# EAGLE schematic FDC9266_floppyboard (EAGLE 9.6.2)
Assembly variants: rcbus
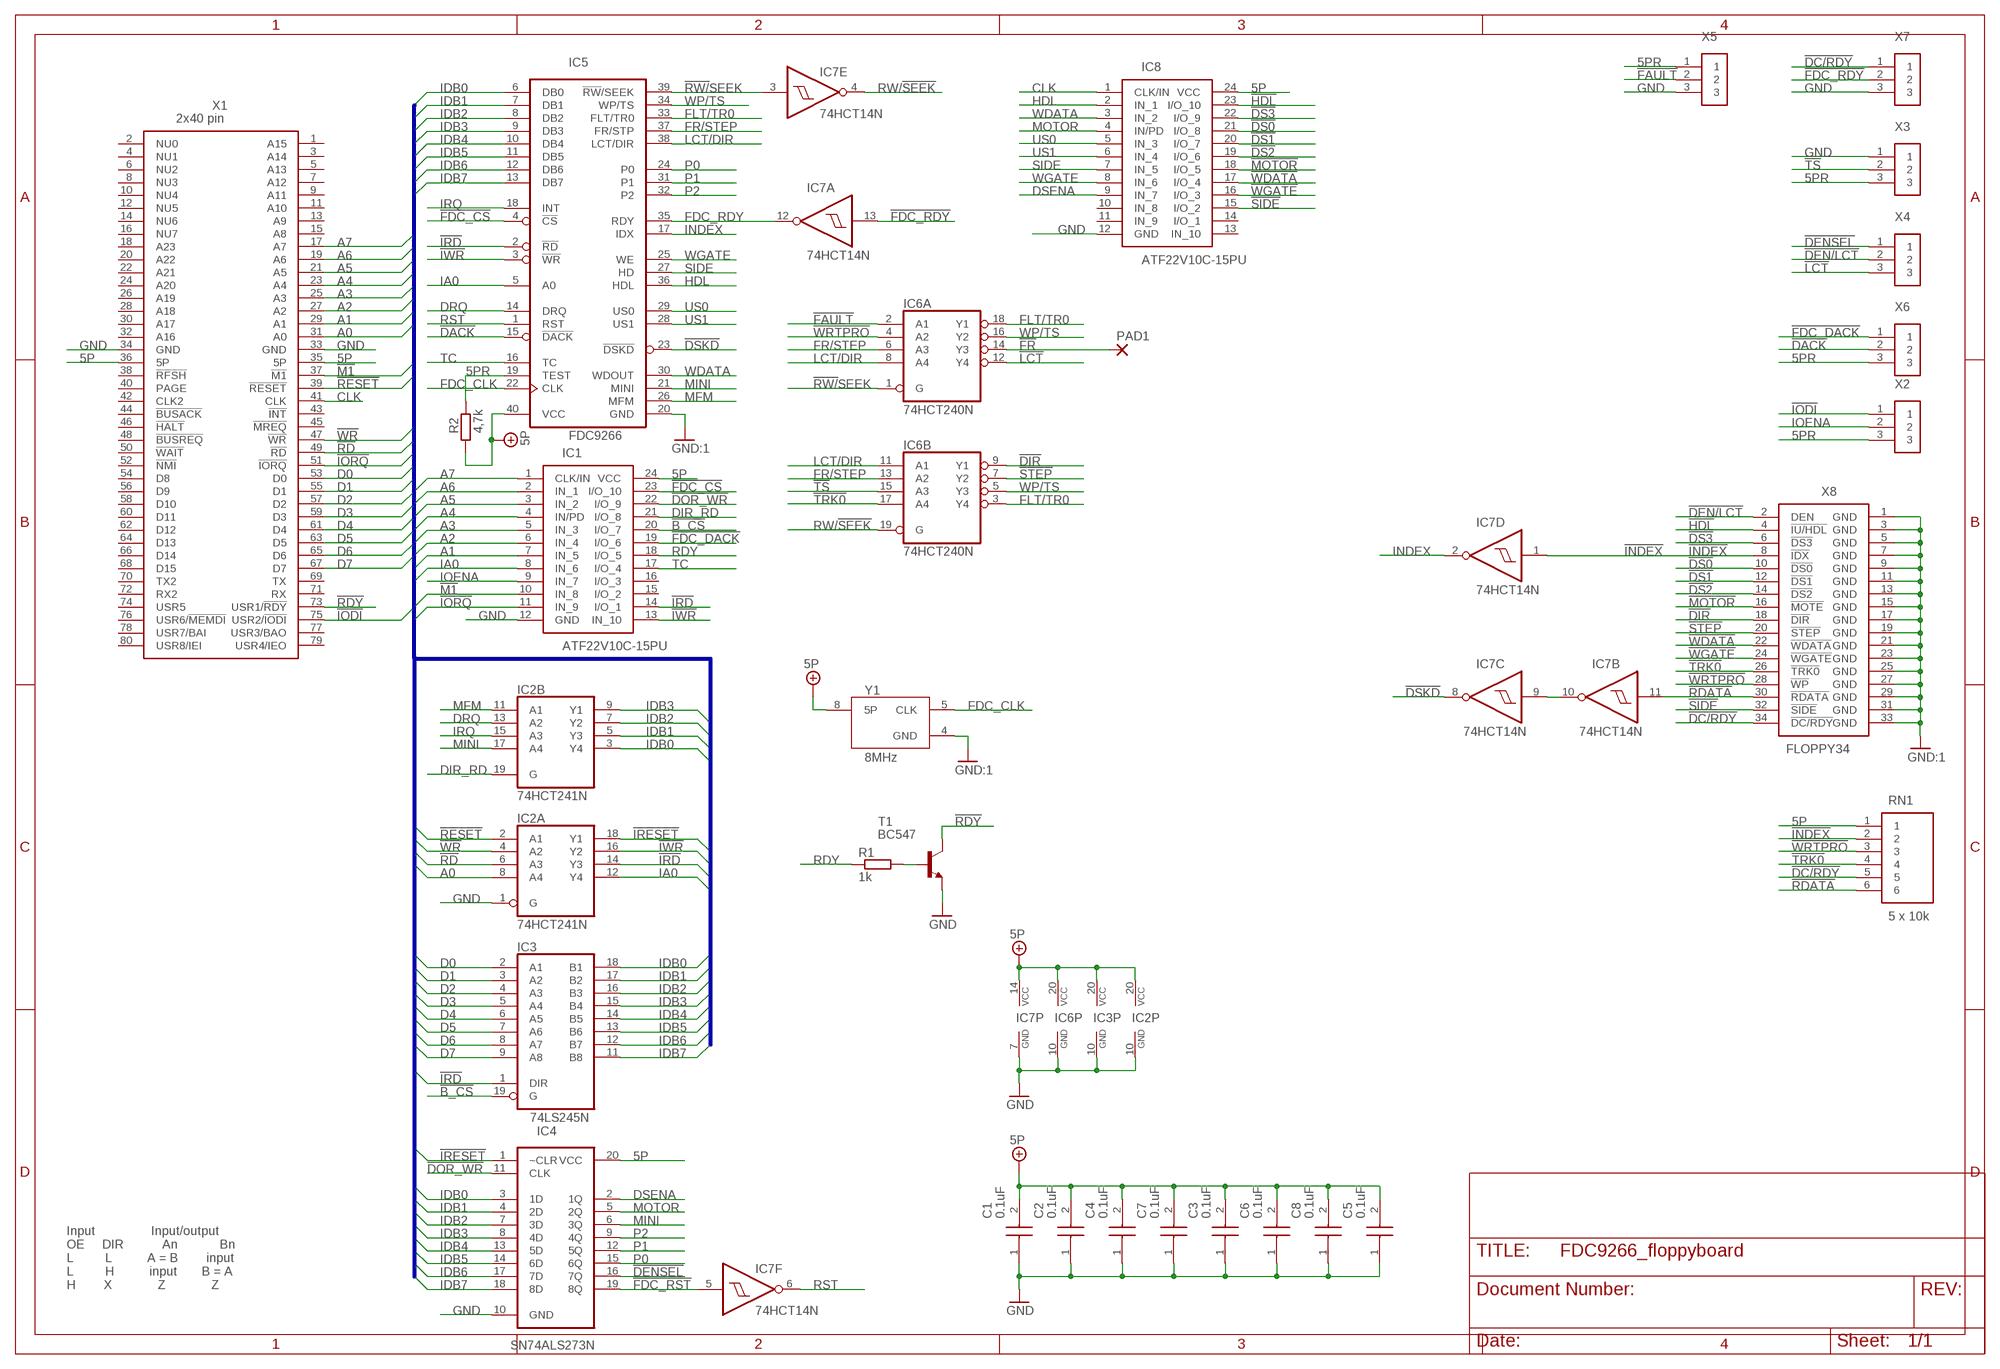
[diagram p0: schematic, sheet 1]

## Parts
C1  0.1uF  C315C103K5R5TA7303  [C315C103K5R5TA7303]
C2  0.1uF  C315C103K5R5TA7303  [C315C103K5R5TA7303]
C3  0.1uF  C315C103K5R5TA7303  [C315C103K5R5TA7303]
C4  0.1uF  C315C103K5R5TA7303  [C315C103K5R5TA7303]
C5  0.1uF  C315C103K5R5TA7303  [C315C103K5R5TA7303]
C6  0.1uF  C315C103K5R5TA7303  [C315C103K5R5TA7303]
C7  0.1uF  C315C103K5R5TA7303  [C315C103K5R5TA7303]
C8  0.1uF  C315C103K5R5TA7303  [C315C103K5R5TA7303]
IC1  ATF22V10C-15PU  [DIP794W56P254L3188H533Q24N]
IC2  74HCT241N  [DIL20]
IC3  74LS245N  [DIL20]
IC4  SN74ALS273N  [DIP254P762X508-20]
IC5  FDC9266  [DIP1550W53P254L5232H424Q40N]
IC6  74HCT240N  [DIL20]
IC7  74HCT14N  [DIL14]
IC8  ATF22V10C-15PU  [DIP794W56P254L3188H533Q24N]
PAD1  WIREPAD1,6/0,8  [1,6/0,8]
R1  1k  R_EU_020710  [0207/10]  (not fitted in variant rcbus)
R2  4,7k  R_EU_020710  [0207/10]
RN1  5 x 10k  4606X-101-103LF  [4606X102103LF]
T1  BC547  [TO92]  (not fitted in variant rcbus)
X1  2x40 pin  RCBUS_80_RA  [RC2014_80_RA]
X2  TSW-103-07-G-S07  [TSW-103-XX-G-S]
X3  TSW-103-07-G-S07  [TSW-103-XX-G-S]
X4  TSW-103-07-G-S07  [TSW-103-XX-G-S]
X5  TSW-103-07-G-S07  [TSW-103-XX-G-S]
X6  TSW-103-07-G-S07  [TSW-103-XX-G-S]
X7  TSW-103-07-G-S07  [TSW-103-XX-G-S]
X8  FLOPPY34  [09185346323]
Y1  8MHz  ECS-2100AX-200  [ECS-2100AX-200]

## Nets
5P: C1.2 C2.2 C3.2 C4.2 C5.2 C6.2 C7.2 C8.2 IC1.24(VCC) IC2.20(P:VCC) IC3.20(VCC) IC4.20(VCC) IC5.40(VCC) IC6.20(P:VCC) IC7.14(P:VCC) IC8.24(VCC) R2.1 RN1.1 X1.35(5P) X1.36(5P) Y1.8(5P)
5PR: IC5.19(TEST) R2.2 X2.3 X3.3 X5.1 X6.3
!B_CS: IC1.20(I/O_7) IC3.19(G)
!DACK: IC5.15(!DACK) X6.2
!DC/RDY: RN1.5 X7.1 X8.34(!DC/RDY)
!DEN/LCT: X4.2 X8.2(DEN)
!DENSEL: IC4.16(7Q) X4.1
!DIR: IC6.9(B:Y1) X8.18(!DIR)
!DOR_WR: IC1.22(I/O_9) IC4.11(CLK)
!DS0: IC8.21(I/O_8) X8.10(!DS0)
!DS1: IC8.20(I/O_7) X8.12(!DS1)
!DS2: IC8.19(I/O_6) X8.14(!DS2)
!DS3: IC8.22(I/O_9) X8.6(!DS3)
!DSKD: IC5.23(!DSKD) IC7.8(C:O)
!FAULT: IC6.2(A:A1) X5.2
!FDC_CS: IC1.23(I/O_10) IC5.4(!CS)
!FDC_DACK: IC1.19(I/O_6) X6.1
!FDC_RDY: IC7.13(A:I) X7.2
!FDC_RST: IC4.19(8Q) IC7.5(F:I)
!FR: IC6.14(A:Y3) PAD1.1(P)
!HDL: IC8.23(I/O_10) X8.4(!IU/HDL)
!INDEX: IC7.1(D:I) RN1.2 X8.8(!IDX)
!IODI: X1.75(USR2/!IODI) X2.1
!IORQ: IC1.11(IN_9) X1.51(!IORQ)
!IRD: IC1.14(I/O_1) IC2.14(A:Y3) IC3.1(DIR) IC5.2(!RD)
!IRESET: IC2.18(A:Y1) IC4.1(~CLR)
!IWR: IC1.13(IN_10) IC2.16(A:Y2) IC5.3(!WR)
!LCT: IC6.12(A:Y4) X4.3
!M1: IC1.10(IN_8) X1.37(!M1)
!MOTOR: IC8.18(I/O_5) X8.16(!MOTE)
!RD: IC2.6(A:A3) X1.49(!RD)
!RDATA: IC7.11(B:I) RN1.6 X8.30(!RDATA)
!RDY: T1.3(C) X1.73(USR1/!RDY)
!RESET: IC2.2(A:A1) X1.39(!RESET)
!RW/!SEEK: IC5.39(!RW!/SEEK) IC6.1(A:G) IC7.3(E:I)
!SIDE: IC8.15(I/O_2) X8.32(!SIDE)
!STEP: IC6.7(B:Y2) X8.20(!STEP)
!TRK0: IC6.17(B:A4) RN1.4 X8.26(!TRK0)
!TS: IC6.15(B:A3) X3.2
!WDATA: IC8.17(I/O_4) X8.22(!WDATA)
!WGATE: IC8.16(I/O_3) X8.24(!WGATE)
!WR: IC2.4(A:A2) X1.47(!WR)
!WRTPRO: IC6.4(A:A2) RN1.3 X8.28(!WP)
A0: IC2.8(A:A4) X1.31(A0)
A1: IC1.7(IN_5) X1.29(A1)
A2: IC1.6(IN_4) X1.27(A2)
A3: IC1.5(IN_3) X1.25(A3)
A4: IC1.4(IN/PD) X1.23(A4)
A5: IC1.3(IN_2) X1.21(A5)
A6: IC1.2(IN_1) X1.19(A6)
A7: IC1.1(CLK/IN) X1.17(A7)
CLK: IC8.1(CLK/IN) X1.41(CLK)
D0: IC3.2(A1) X1.53(D0)
D1: IC3.3(A2) X1.55(D1)
D2: IC3.4(A3) X1.57(D2)
D3: IC3.5(A4) X1.59(D3)
D4: IC3.6(A5) X1.61(D4)
D5: IC3.7(A6) X1.63(D5)
D6: IC3.8(A7) X1.65(D6)
D7: IC3.9(A8) X1.67(D7)
DIR_RD: IC1.21(I/O_8) IC2.19(B:G)
DRQ: IC2.13(B:A2) IC5.14(DRQ)
DSENA: IC4.2(1Q) IC8.9(IN_7)
FDC_CLK: IC5.22(CLK) Y1.5(CLK)
FDC_RDY: IC5.35(RDY) IC7.12(A:O)
FLT/TR0: IC5.33(FLT/TR0) IC6.3(B:Y4) IC6.18(A:Y1)
FR/STEP: IC5.37(FR/STP) IC6.6(A:A3) IC6.13(B:A2)
GND: C1.1 C2.1 C3.1 C4.1 C5.1 C6.1 C7.1 C8.1 IC1.12(GND) IC2.1(A:G) IC2.10(P:GND) IC3.10(GND) IC4.10(GND) IC5.20(GND) IC6.10(P:GND) IC7.7(P:GND) IC8.12(GND) T1.1(E) X1.33(GND) X1.34(GND) X3.1 X5.3 X7.3 X8.1(GND) X8.3(GND) X8.5(GND) X8.7(GND) X8.9(GND) X8.11(GND) X8.13(GND) X8.15(GND) X8.17(GND) X8.19(GND) X8.21(GND) X8.23(GND) X8.25(GND) X8.27(GND) X8.29(GND) X8.31(GND) X8.33(GND) Y1.4(GND) ; supply symbol labelled GND:1
HDL: IC5.36(HDL) IC8.2(IN_1)
IA0: IC1.8(IN_6) IC2.12(A:Y4) IC5.5(A0)
IDB0: IC2.3(B:Y4) IC3.18(B1) IC4.3(1D) IC5.6(DB0)
IDB1: IC2.5(B:Y3) IC3.17(B2) IC4.4(2D) IC5.7(DB1)
IDB2: IC2.7(B:Y2) IC3.16(B3) IC4.7(3D) IC5.8(DB2)
IDB3: IC2.9(B:Y1) IC3.15(B4) IC4.8(4D) IC5.9(DB3)
IDB4: IC3.14(B5) IC4.13(5D) IC5.10(DB4)
IDB5: IC3.13(B6) IC4.14(6D) IC5.11(DB5)
IDB6: IC3.12(B7) IC4.17(7D) IC5.12(DB6)
IDB7: IC3.11(B8) IC4.18(8D) IC5.13(DB7)
INDEX: IC5.17(IDX) IC7.2(D:O)
IOENA: IC1.9(IN_7) X2.2
IRQ: IC2.15(B:A3) IC5.18(INT)
LCT/DIR: IC5.38(LCT/DIR) IC6.8(A:A4) IC6.11(B:A1)
MFM: IC2.11(B:A1) IC5.26(MFM)
MINI: IC2.17(B:A4) IC4.6(3Q) IC5.21(MINI)
MOTOR: IC4.5(2Q) IC8.4(IN/PD)
N$1: IC7.9(C:I) IC7.10(B:O)
N$3: R1.2 T1.2(B)
P0: IC4.15(6Q) IC5.24(P0)
P1: IC4.12(5Q) IC5.31(P1)
P2: IC4.9(4Q) IC5.32(P2)
RDY: IC1.18(I/O_5) R1.1
RST: IC5.1(RST) IC7.6(F:O)
RW/!SEEK: IC6.19(B:G) IC7.4(E:O)
SIDE: IC5.27(HD) IC8.7(IN_5)
TC: IC1.17(I/O_4) IC5.16(TC)
US0: IC5.29(US0) IC8.5(IN_3)
US1: IC5.28(US1) IC8.6(IN_4)
WDATA: IC5.30(WDOUT) IC8.3(IN_2)
WGATE: IC5.25(WE) IC8.8(IN_6)
WP/TS: IC5.34(WP/TS) IC6.5(B:Y3) IC6.16(A:Y2)
Unconnected: IC1.15(I/O_2) IC1.16(I/O_3) IC8.10(IN_8) IC8.11(IN_9) IC8.13(IN_10) IC8.14(I/O_1) X1.1(A15) X1.2(NU0) X1.3(A14) X1.4(NU1) X1.5(A13) X1.6(NU2) X1.7(A12) X1.8(NU3) X1.9(A11) X1.10(NU4) X1.11(A10) X1.12(NU5) X1.13(A9) X1.14(NU6) X1.15(A8) X1.16(NU7) X1.18(A23) X1.20(A22) X1.22(A21) X1.24(A20) X1.26(A19) X1.28(A18) X1.30(A17) X1.32(A16) X1.38(!RFSH) X1.40(PAGE) X1.42(CLK2) X1.43(!INT) X1.44(!BUSACK) X1.45(!MREQ) X1.46(!HALT) X1.48(!BUSREQ) X1.50(!WAIT) X1.52(!NMI) X1.54(D8) X1.56(D9) X1.58(D10) X1.60(D11) X1.62(D12) X1.64(D13) X1.66(D14) X1.68(D15) X1.69(TX) X1.70(TX2) X1.71(RX) X1.72(RX2) X1.74(USR5) X1.76(USR6/!MEMDI) X1.77(USR3/BAO) X1.78(USR7/BAI) X1.79(USR4/IEO) X1.80(USR8/IEI)

## Buses
A[0..7],CLK,D[0..7],IA0,IDB[0..7],!IODI,!IORQ,!IRD,!IRESET,!IWR,!M1,!RD,!RESET,!WR

## Notes on the sheet
- Input                Input/output
  OE     DIR           An            Bn
  L         L          A = B        input
  L         H          input       B = A
  H        X             Z             Z

## Library data of the parts
C1-C8 = FDC9266_floppy_korr:C315C103K5R5TA7303: GoldMax 300 Comm X7R, Ceramic, 0.01 uF, 10%, 50 VDC, 125 VDC, 125C, -55C, X7R, GoldMax, Commercial Standard, 2.5 % , 100 GOhms, 3.81mm, 3.14mm, 2.54mm, Lead Spacing = 2.54mm, 18mm, 0.51mm, 2500, 80 Source: Datasheet <https://content.kemet.com/datasheets/KEM_C1050_GOLDMAX_X7R.pdf>; ARROW_PART_NUMBER: C315C103K5R5TA7303; ARROW_PRICE-STOCK: https://www.arrow.com/en/products/c315c103k5r5ta7303/kemet-corporation?region=nac; DESCRIPTION: GoldMax 300 Comm X7R, Ceramic, 0.01 uF, 10%, 50 VDC, 125 VDC, 125C, -55C, X7R, GoldMax, Commercial Standard, 2.5 % , 100 GOhms, 3.81mm, 3.14mm, 2.54mm, Lead Spacing = 2.54mm, 18mm, 0.51mm, 2500, 80; HEIGHT: 4.66mm; MANUFACTURER_NAME: KEMET; MANUFACTURER_PART_NUMBER: C315C103K5R5TA7303; MOUSER_PART_NUMBER: 80-C315C103K5R-TR; MOUSER_PRICE-STOCK: https://www.mouser.co.uk/ProductDetail/KEMET/C315C103K5R5TA7303?qs=LJ1pyEEo5rYBfSJP9%252BZ%252BkA%3D%3D
IC1 IC8 = FDC9266_floppy_korr:ATF22V10C-15PU: Microchip ATF22V10C-15PU, SPLD Simple Programmable Logic Device Source: Datasheet <http://ww1.microchip.com/downloads/en/DeviceDoc/doc0735.pdf>; ARROW_PART_NUMBER: ATF22V10C-15PU; ARROW_PRICE-STOCK: https://www.arrow.com/en/products/atf22v10c-15pu/microchip-technology?region=nac; DESCRIPTION: Microchip ATF22V10C-15PU, SPLD Simple Programmable Logic Device; HEIGHT: 5.334mm; MANUFACTURER_NAME: Microchip; MANUFACTURER_PART_NUMBER: ATF22V10C-15PU; MOUSER_PART_NUMBER: 556-AF22V10C15PU; MOUSER_PRICE-STOCK: https://www.mouser.co.uk/ProductDetail/Microchip-Technology-Atmel/ATF22V10C-15PU?qs=2mdvTlUeTfCr46ZvfjTtAg%3D%3D
IC2 = FDC9266_floppy_korr:74*241: Octal BUFFER and LINE DRIVER, 3-state
IC3 = FDC9266_floppy_korr:74*245: Octal BUS TRANSCEIVER, 3-state
IC4 = FDC9266_floppy_korr:SN74ALS273N: OCTAL D-TYPE FLIP-FLOPS; MPN: SN74ALS273N; OC_FARNELL: 1607723; OC_NEWARK: 08F6025; PACKAGE: PDIP-20; SUPPLIER: Texas Instruments
IC5 = FDC9266_floppy_korr:FDC9266: FDC9266 MFM Disk Controller
IC6 = FDC9266_floppy_korr:74*240: Octal BUFFER and LINE DRIVER, 3-state
IC7 = FDC9266_floppy_korr:74*14: Hex schmitt trigger INVERTER
PAD1 = FDC9266_floppy_korr:WIREPAD: Wire PAD connect wire on PCB
R1 R2 = FDC9266_floppy_korr:R_EU_0207: RESISTOR, European symbol; SPICEPREFIX: R
RN1 = FDC9266_floppy_korr:4606X-101-103LF: 5-bussed thick film resistor,10K 0.2W Bourns Bussed Resistor Network 10k +/-2% 5 Resistors, 0.75W Total, SIP package 4600X Through Hole Source: Datasheet <https://www.bourns.com/pdfs/4600X.pdf>; ARROW_PART_NUMBER: 4606X-101-103LF; ARROW_PRICE-STOCK: https://www.arrow.com/en/products/4606x-101-103lf/bourns?region=europe; DESCRIPTION: 5-bussed thick film resistor,10K 0.2W Bourns Bussed Resistor Network 10k +/-2% 5 Resistors, 0.75W Total, SIP package 4600X Through Hole; HEIGHT: 5mm; MANUFACTURER_NAME: Bourns; MANUFACTURER_PART_NUMBER: 4606X-101-103LF; MOUSER_PART_NUMBER: 652-4606X-1LF-10K; MOUSER_PRICE-STOCK: https://www.mouser.co.uk/ProductDetail/Bourns/4606X-101-103LF?qs=Qv7qbSW4mEHqAfbN3SBBUw%3D%3D
T1 = FDC9266_floppy_korr:BC547: NPN TRANSISTOR
X1 = FDC9266_floppy_korr:RCBUS_80_RA: RC2014 extended bus 80 pin board connector
X2-X7 = FDC9266_floppy_korr:TSW-103-07-G-S: THROUGH-HOLE .025" SQ POST HEADER Source: Samtec TSW.pdf; MF: Samtec Inc.; MPN: TSW-103-07-G-S
X8 = FDC9266_floppy_korr:FLOPPY34: Connectors, Male connector, Wave soldering termination, Rated current: 1 A, Angled, Copper alloy, Sn over Ni, Termination side, Au over Pd/Ni, Mating side, Performance level: 2, Thermoplastic resin (PBT), Grey Source: Datasheet <https://b2b.harting.com/files/download/PRD/PDF_TS/09185XXX323_100154466DRW007A.pdf?showPrivacyEmailAgreement=false&contextURL=https://b2b.harting.com/ebusiness/en_us&siteName=Ebusiness Site&autoLogoutEnabled=true&autoLogoutTime=1805>; ARROW_PART_NUMBER: 09185346323; ARROW_PRICE-STOCK: https://www.arrow.com/en/products/09185346323/harting?region=nac; DESCRIPTION: Connectors, Male connector, Wave soldering termination, Rated current: 1 A, Angled, Copper alloy, Sn over Ni, Termination side, Au over Pd/Ni, Mating side, Performance level: 2, Thermoplastic resin (PBT), Grey; HEIGHT: 8.9mm; MANUFACTURER_NAME: HARTING; MANUFACTURER_PART_NUMBER: 09185346323; MOUSER_PART_NUMBER: 617-09-18-534-6323; MOUSER_PRICE-STOCK: https://www.mouser.co.uk/ProductDetail/HARTING/09185346323?qs=GZB%2FOSW0r0GMbz7Zhp6Wbw%3D%3D
Y1 = FDC9266_floppy_korr:ECS-2100AX-200: XTAL OSC XO 20.0000MHZ HCMOS TTL Manufacturer's datasheet <https://ecsxtal.com/store/pdf/ecs-2100x.pdf>; CREATED_BY: PCBLayout.com; DIGIKEY_PART_NUMBER: X964-ND; MANUFACTURER: ECS Inc.; MPN: ECS-2100AX-200; PACKAGE: 8-DIP

## Net classes
0 default: width 0.254 mm
1 pwr: width 1.016 mm